# Altium schematic sheet Final_SCH.SchDoc: Наименование
size A3; ApprovedBy: Утвердил; CheckedBy: Проверил; Author: Разработал; CompanyName: Организация; DrawnBy: Н.Контр; Engineer: Т.Контр; SheetNumber: 1; SheetTotal: 1; PageSetup: Record=PageOptions|CenterHorizontal=True|CenterVertical=True|PrintScale=0.94|XCorrection=1.00|YCorrection=1.00|PrintKind=1|BorderSize=5000000|LeftOffset=0|BottomOffset=0|Orientation=1|PaperLength=1000|PaperWidth=1000|Scale=100|PaperSource=7|PrintQuality=-4|MediaType=1|DitherType=10|PaperKind=A4|PrintScaleMode=1; DecimalNumber: Децимальный номер; HeadOfSector: Нач. сектора; MainDevice: Перв.примен.; Name: Наименование; DocumentName: Sheet1.SCHDOC
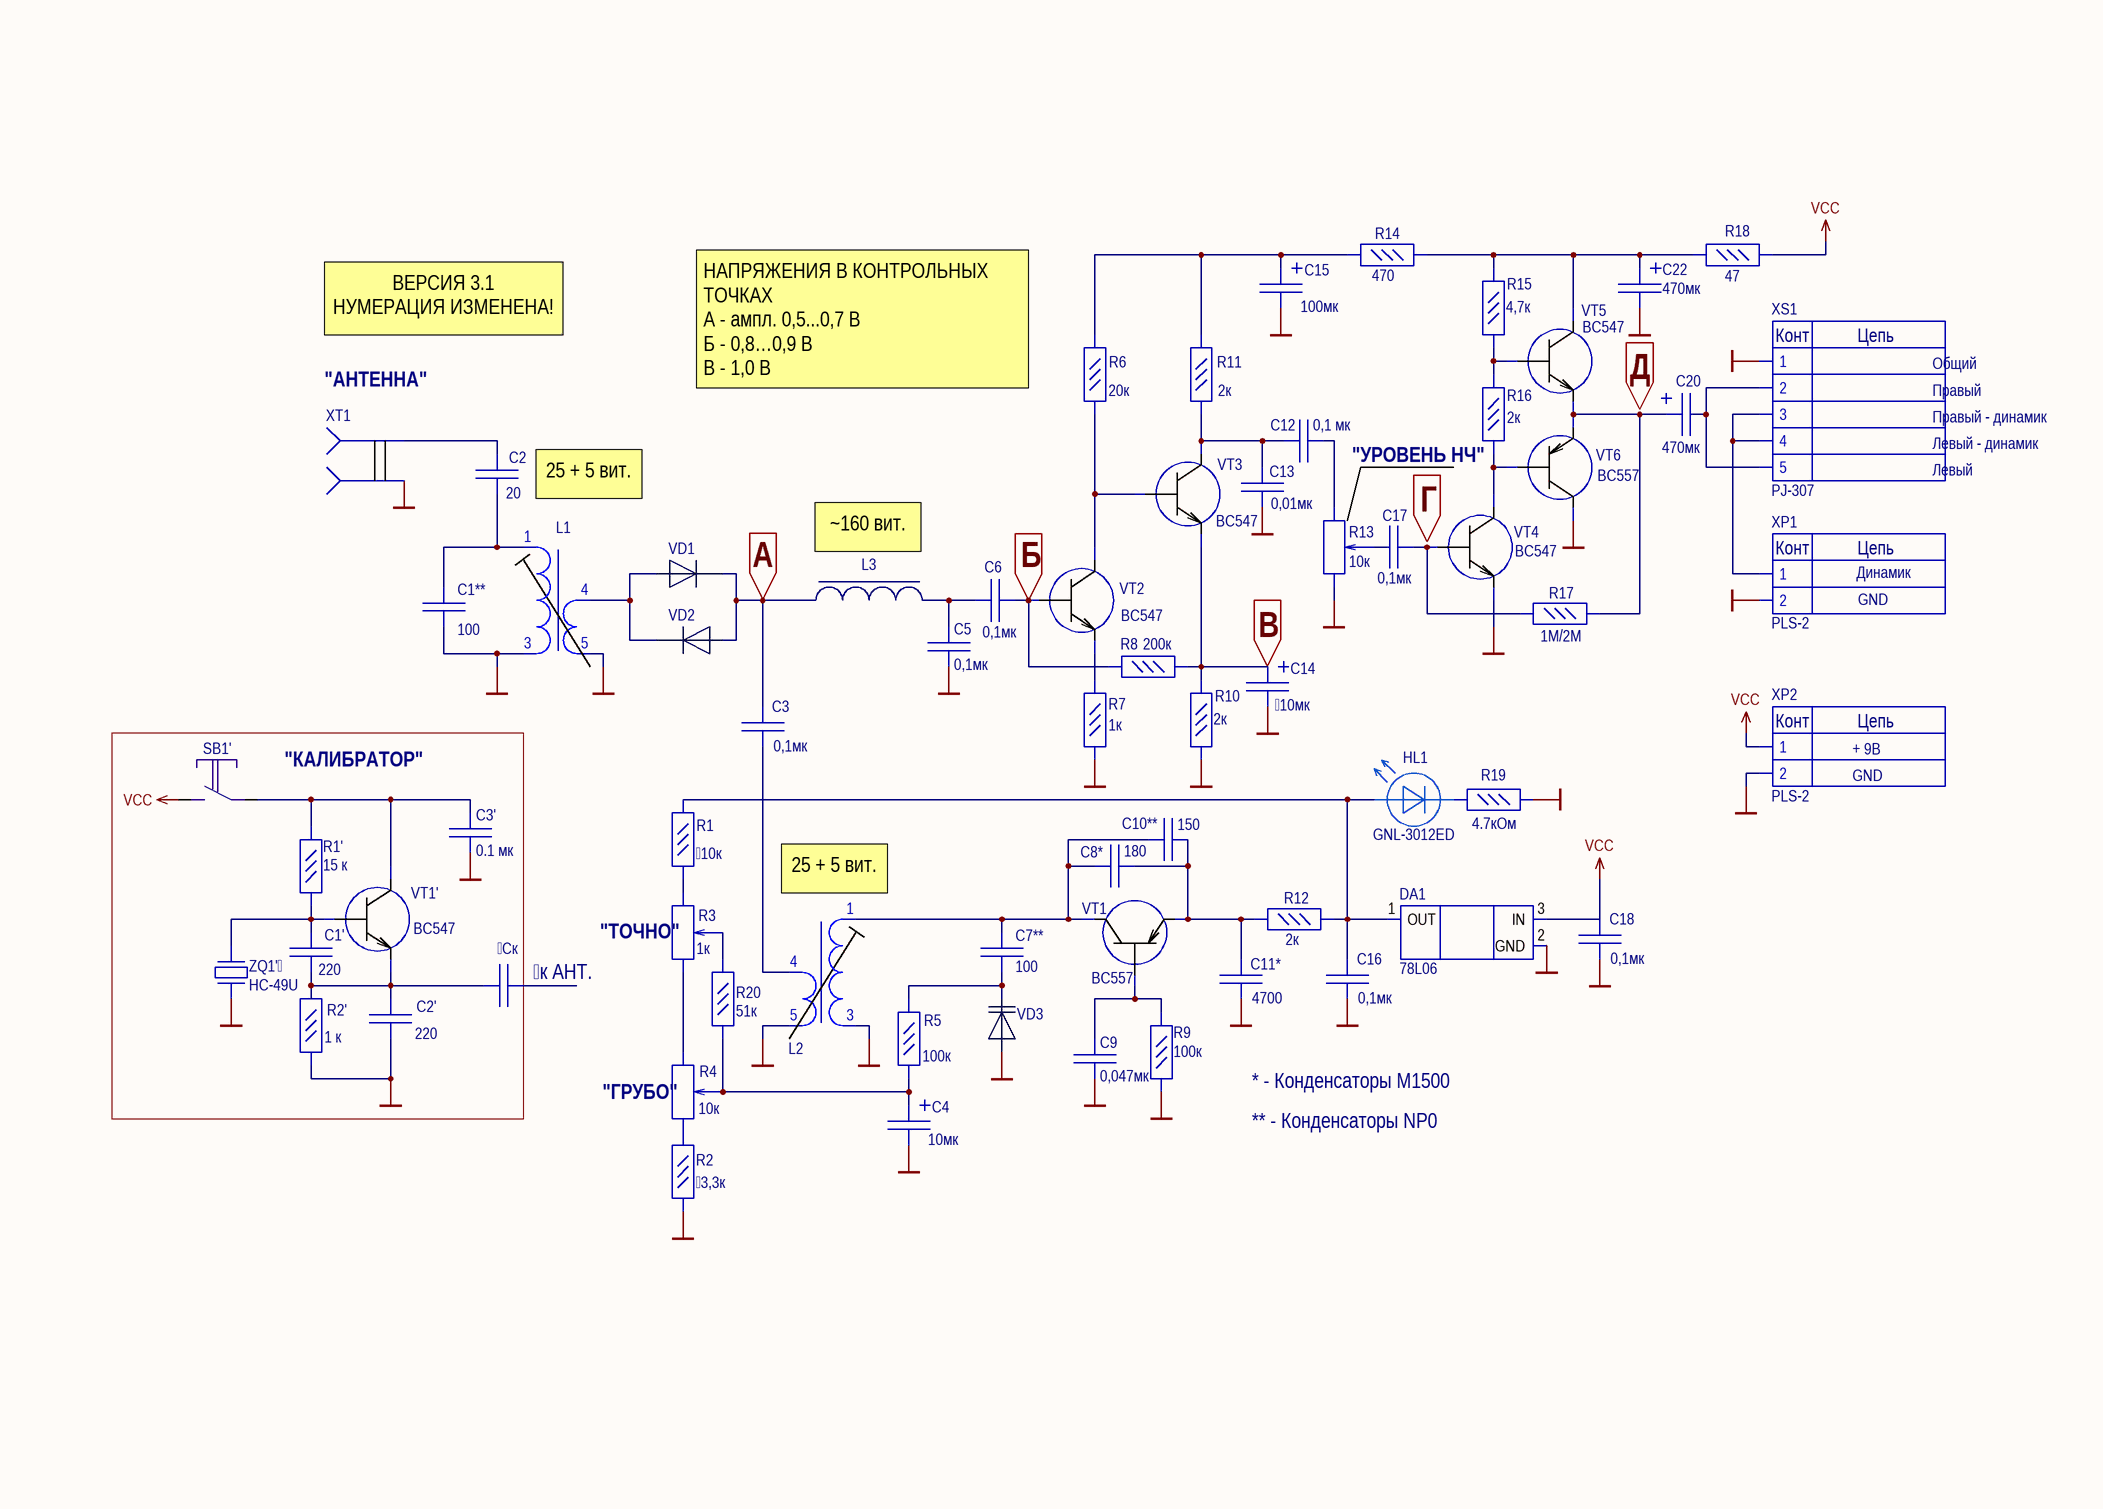
[diagram p0: Final_SCH.SchDoc]

## Parts
Ск  0.1 мк  [К10-17Б]  (value not drawn)
C1'  220  [К10-17Б]
C1**  100  [К10-17Б]
C2  20  [К10-17Б]
C2'  220  [К10-17Б]
C3  0,1мк  [К10-17Б]
C3'  0.1 мк  [К10-17Б]
C4  10мк  [К50-35]
C5  0,1мк  [К10-17Б]
C6  0,1мк  [К10-17Б]
C7**  100  [К10-17Б]
C8*  180  [К10-17Б]
C9  0,047мк  [К10-17Б]
C10**  150  [К10-17Б]
C11*  4700  [К10-17Б]
C12  0,1 мк  [К10-17Б]
C13  0,01мк  [К10-17Б]
C14  10мк  [К50-35]
C15  100мк  [К50-35]
C16  0,1мк  [К10-17Б]
C17  0,1мк  [К10-17Б]
C18  0,1мк  [К10-17Б]
C20  470мк  [К50-35]
C22  470мк  [К50-35]
DA1  78L06  [КТ-26]
HL1  GNL-3012ED  [GNL-3012ED]
L1  Trim_coil_2  [trim_coil]  (value not drawn)
L2  Trim_coil_2  [trim_coil]  (value not drawn)
L3  T50-6  [T50-6]  (value not drawn)
R1  10к  [С1-4]
R1'  15 к  [С1-4]
R2  3,3к  [С1-4]
R2'  1 к  [С1-4]
R3  1к  [WH148R]
R4  10к  [WH148R]
R5  100к  [С1-4]
R6  20к  [С1-4]
R7  1к  [С1-4]
R8  200к  [С1-4]
R9  100к  [С1-4]
R10  2к  [С1-4]
R11  2к  [С1-4]
R12  2к  [С1-4]
R13  10к  [WH148R]
R14  470  [С1-4]
R15  4,7к  [С1-4]
R16  2к  [С1-4]
R17  1М/2М  [С1-4]
R18  47  [С1-4]
R19  4.7кОм  [С1-4]
R20  51к  [С1-4]
SB1'  KLS7-TS6601  [KLS7-TS6601]  (value not drawn)
VD1  1N4148  [DO35]  (value not drawn)
VD2  1N4148  [DO35]  (value not drawn)
VD3  BB133  [SOD323]  (value not drawn)
VT1  BC557  [КТ-26]
VT1'  BC547  [КТ-26]
VT2  BC547  [КТ-26]
VT3  BC547  [КТ-26]
VT4  BC547  [КТ-26]
VT5  BC547  [КТ-26]
VT6  BC557  [КТ-26]
XP1  PLS-2  [PLS-2]
XP2  PLS-2  [PLS-2]
XS1  PJ-307  [PJ-307]
XT1  DG308-2.54-02P  [DG308-2.54-02P]  (value not drawn)
ZQ1'  HC-49U  [HC-49U]

## Blocks framed on the sheet
"КАЛИБРАТОР": Ск C1' C2' C3' R1' R2' SB1' VT1' ZQ1'

## Nets
GND: C1**.1 C2'.2 C3'.1 C4.2 C5.1 C9.1 C11*.1 C13.1 C14.2 C15.2 C16.1 C18.1 C22.2 DA1.2(GND) L1.3 L1.5 L2.3 L2.5 R2.1 R2'.1 R7.1 R9.1 R10.1 R13.3 R19.1 VD3.2 VT4.3(E) VT6.1(C) XP1.2 XP2.2 XS1.1 XT1.2 ZQ1'.2
VCC: C18.2 DA1.3(IN) R18.1 SB1'.1 XP2.1
NetСк_2: Ск.2 C1'.2 C2'.1 R2'.2 VT1'.3(E)
NetC1'_1: C1'.1 R1'.1 VT1'.2(B) ZQ1'.1
NetC1**_2: C1**.2 C2.1 L1.1
NetC2_2: C2.2 XT1.1
NetC3'_2: C3'.2 R1'.2 SB1'.2 VT1'.1(C)
NetC3_1: C3.1 L2.4
NetC3_2: C3.2 L3.1 VD1.2 VD2.1
NetC4_1: C4.1 R4.2 R5.1 R20.2
NetC5_2: C5.2 C6.2 L3.2
NetC6_1: C6.1 R8.2 VT2.2(B)
NetC7**_1: C7**.1 C8*.2 C10**.2 L2.1 VT1.1(C)
NetC7**_2: C7**.2 R5.2 VD3.1
NetC8*_1: C8*.1 C10**.1 C11*.2 R12.1 VT1.3(E)
NetC9_2: C9.2 R9.2 VT1.2(B)
NetC12_1: C12.1 R13.1
NetC12_2: C12.2 C13.2 R11.1 VT3.1(C)
NetC14_1: C14.1 R8.1 R10.2 VT3.3(E)
NetC15_1: C15.1 R6.2 R11.2 R14.2
NetC16_2: C16.2 DA1.1(OUT) HL1.1 R1.2 R12.2
NetC17_1: C17.1 R17.2 VT4.2(B)
NetC17_2: C17.2 R13.2
NetC20_1: C20.1 R17.1 VT5.3(E) VT6.3(E)
NetC20_2: C20.2 XS1.2 XS1.5
NetC22_1: C22.1 R14.1 R15.2 R18.2 VT5.1(C)
NetHL1_2: HL1.2 R19.2
NetL1_4: L1.4 VD1.1 VD2.2
NetR1_1: R1.1 R3.1
NetR2_2: R2.2 R4.3
NetR3_2: R3.2 R20.1
NetR3_3: R3.3 R4.1
NetR6_1: R6.1 VT2.1(C) VT3.2(B)
NetR7_2: R7.2 VT2.3(E)
NetR15_1: R15.1 R16.2 VT5.2(B)
NetR16_1: R16.1 VT4.1(C) VT6.2(B)
NetXP1_1: XP1.1 XS1.3 XS1.4

Not connected (* = marked no-connect by the designer): Ск 1

## Notes on the sheet
- ВЕРСИЯ 3.1
  НУМЕРАЦИЯ ИЗМЕНЕНА!
- НАПРЯЖЕНИЯ В КОНТРОЛЬНЫХ ТОЧКАХ
  А - ампл. 0,5...0,7 В
  Б - 0,8…0,9 В
  В - 1,0 В
  Г - 0,65 В
- Д
- (near XT1) "АНТЕННА"
- 25 + 5 вит.
- (near R16) "УРОВЕНЬ НЧ"
- (near VT4) Г
- A
- (near L3) ~160 вит.
- (near VT2) Б
- Динамик
- (near C14) В
- GND
- + 9В
- (near L2) 25 + 5 вит.
- (near Ск) к АНТ.
- (near R3) "ТОЧНО"
- (near R4) "ГРУБО"
- * - Конденсаторы М1500
- ** - Конденсаторы NP0
- Подп. и дата
- Инв.№ дубл.
- Взам.инв.№
- Подп.и дата
- Инв.№ подл.
- Изм.
- Лист
- № докум.
- Подп.
- Дата
- Формат  A3
- (in symbol PJ-307) Конт; Цепь; Общий; Правый; Правый - динамик; Левый - динамик; Левый
- (in symbol PLS-2) Конт; Цепь

## Library data of the parts
Ск C1' C1** C2 C2' C3 C3' C5 C6 C7** C8* C9 C10** C11* C12 C13 C16-C18 = C_К10-17Б
C4 C14 C15 C20 C22 = K50-35
R1 R1' R2 R2' R5-R12 R14-R20 = R_C1-4
R3 R4 R13 = WH148
VD1 VD2 = 1N4148: Диод
VD3 = BB133: VHF variable capacitance diode